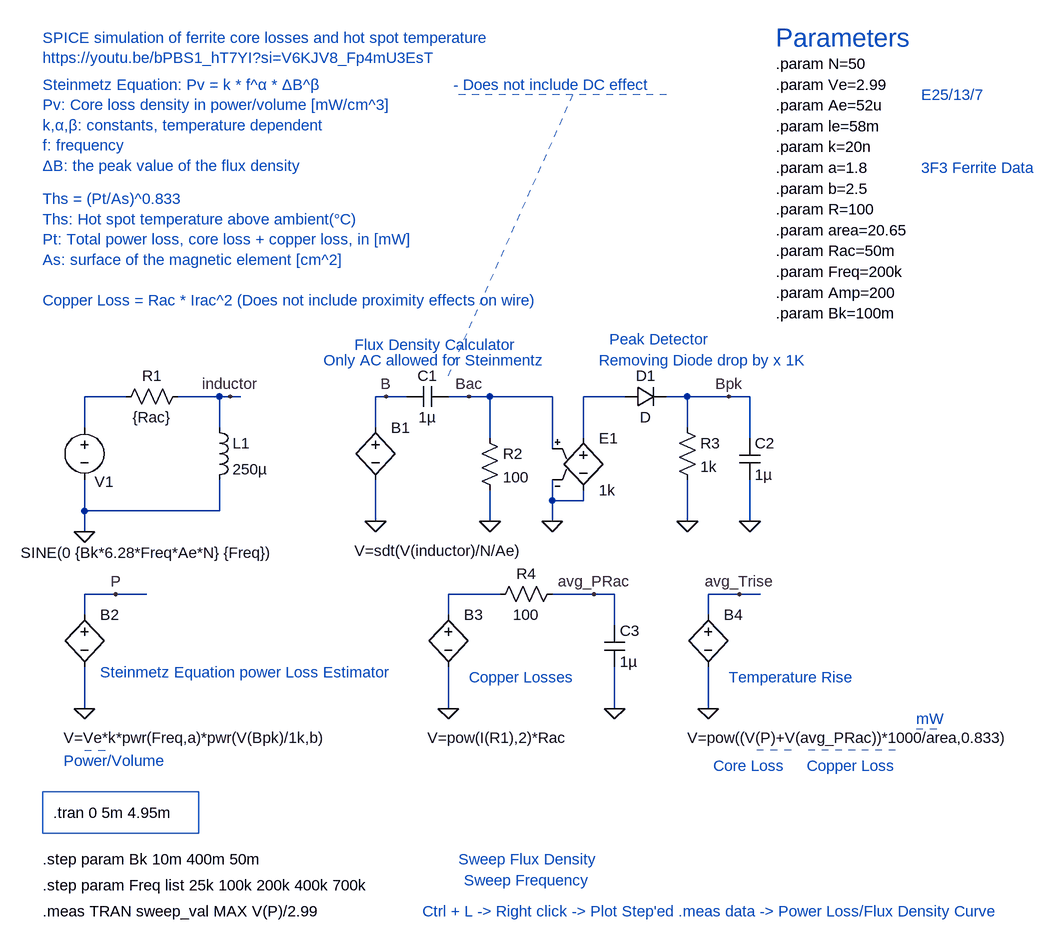
[diagram p0: schematic 05-ferrite_core_loss_max_temperature.asc]
05-ferrite_core_loss_max_temperature.asc, the LTspice schematic file:
Version 4
SHEET 1 1600 1400
WIRE -16 576 -80 576
WIRE 128 576 64 576
WIRE 144 576 128 576
WIRE 160 576 144 576
WIRE 384 576 368 576
WIRE 416 576 384 576
WIRE 512 576 480 576
WIRE 544 576 512 576
WIRE 640 576 544 576
WIRE 752 576 688 576
WIRE 848 576 816 576
WIRE 912 576 848 576
WIRE 944 576 912 576
WIRE -80 624 -80 576
WIRE 128 624 128 576
WIRE 368 624 368 576
WIRE 848 624 848 576
WIRE 544 640 544 576
WIRE 688 640 688 576
WIRE 944 640 944 576
WIRE 640 656 640 576
WIRE 640 736 640 704
WIRE 688 736 688 720
WIRE 688 736 640 736
WIRE -80 752 -80 704
WIRE 128 752 128 704
WIRE 128 752 -80 752
WIRE 368 768 368 704
WIRE 544 768 544 720
WIRE 640 768 640 736
WIRE 848 768 848 704
WIRE 944 768 944 704
WIRE -80 784 -80 752
WIRE -32 880 -80 880
WIRE 16 880 -32 880
WIRE 560 880 480 880
WIRE 704 880 640 880
WIRE 736 880 704 880
WIRE 928 880 880 880
WIRE 960 880 928 880
WIRE -80 912 -80 880
WIRE 480 912 480 880
WIRE 880 912 880 880
WIRE 736 928 736 880
WIRE -80 1056 -80 992
WIRE 480 1056 480 992
WIRE 736 1056 736 992
WIRE 880 1056 880 992
FLAG -80 784 0
FLAG 144 576 inductor
FLAG 368 768 0
FLAG 384 576 B
FLAG 544 768 0
FLAG 512 576 Bac
FLAG 640 768 0
FLAG 848 768 0
FLAG 944 768 0
FLAG 912 576 Bpk
FLAG -80 1056 0
FLAG -32 880 P
FLAG 480 1056 0
FLAG 704 880 avg_PRac
FLAG 736 1056 0
FLAG 880 1056 0
FLAG 928 880 avg_Trise
SYMBOL voltage -80 608 R0
WINDOW 0 16 99 Left 2
WINDOW 3 -98 208 Left 2
WINDOW 123 0 0 Left 0
WINDOW 39 0 0 Left 0
SYMATTR InstName V1
SYMATTR Value SINE(0 {Bk*6.28*Freq*Ae*N} {Freq})
SYMBOL res 80 560 R90
WINDOW 0 0 56 VBottom 2
WINDOW 3 32 56 VTop 2
SYMATTR InstName R1
SYMATTR Value {Rac}
SYMBOL ind 112 608 R0
SYMATTR InstName L1
SYMATTR Value 250µ
SYMBOL bv 368 608 R0
WINDOW 3 -32 205 Left 2
SYMATTR Value V=sdt(V(inductor)/N/Ae)
SYMATTR InstName B1
SYMBOL res 528 624 R0
SYMATTR InstName R2
SYMATTR Value 100
SYMBOL cap 480 560 R90
WINDOW 0 0 32 VBottom 2
WINDOW 3 32 32 VTop 2
SYMATTR InstName C1
SYMATTR Value 1µ
SYMBOL e 688 624 R0
SYMATTR InstName E1
SYMATTR Value 1k
SYMBOL diode 752 592 R270
WINDOW 0 32 32 VTop 2
WINDOW 3 0 32 VBottom 2
SYMATTR InstName D1
SYMBOL res 832 608 R0
SYMATTR InstName R3
SYMATTR Value 1k
SYMBOL cap 928 640 R0
SYMATTR InstName C2
SYMATTR Value 1µ
SYMBOL bv -80 896 R0
WINDOW 3 -32 205 Left 2
SYMATTR Value V=Ve*k*pwr(Freq,a)*pwr(V(Bpk)/1k,b)
SYMATTR InstName B2
SYMBOL bv 480 896 R0
WINDOW 3 -32 205 Left 2
SYMATTR Value V=pow(I(R1),2)*Rac
SYMATTR InstName B3
SYMBOL res 656 864 R90
WINDOW 0 0 56 VBottom 2
WINDOW 3 32 56 VTop 2
SYMATTR InstName R4
SYMATTR Value 100
SYMBOL cap 720 928 R0
SYMATTR InstName C3
SYMATTR Value 1µ
SYMBOL bv 880 896 R0
WINDOW 3 -32 205 Left 2
SYMATTR Value V=pow((V(P)+V(avg_PRac))*1000/area,0.833)
SYMATTR InstName B4
TEXT -144 24 Left 2 ;SPICE simulation of ferrite core losses and hot spot temperature\nhttps://youtu.be/bPBS1_hT7YI?si=V6KJV8_Fp4mU3EsT
TEXT -144 96 Left 2 ;Steinmetz Equation: Pv = k * f^α * ΔB^β\nPv: Core loss density in power/volume [mW/cm^3]\nk,α,β: constants, temperature dependent\nf: frequency\nΔB: the peak value of the flux density
TEXT 488 96 Left 2 ;- Does not include DC effect
TEXT -144 272 Left 2 ;Ths = (Pt/As)^0.833\nThs: Hot spot temperature above ambient(°C)\nPt: Total power loss, core loss + copper loss, in [mW]\nAs: surface of the magnetic element [cm^2]\n \nCopper Loss = Rac * Irac^2 (Does not include proximity effects on wire)
TEXT 984 64 Left 2 !.param N=50
TEXT 984 24 Left 4 ;Parameters
TEXT 984 96 Left 2 !.param Ve=2.99
TEXT 984 128 Left 2 !.param Ae=52u
TEXT 984 160 Left 2 !.param le=58m
TEXT 984 192 Left 2 !.param k=20n
TEXT 984 224 Left 2 !.param a=1.8
TEXT 984 256 Left 2 !.param b=2.5
TEXT 984 288 Left 2 !.param R=100
TEXT 984 320 Left 2 !.param area=20.65
TEXT 984 352 Left 2 !.param Rac=50m
TEXT 984 384 Left 2 !.param Freq=200k
TEXT 984 416 Left 2 !.param Amp=200
TEXT 984 448 Left 2 !.param Bk=100m
TEXT 1208 112 Left 2 ;E25/13/7
TEXT 1208 224 Left 2 ;3F3 Ferrite Data
TEXT -128 1216 Left 2 !.tran 0 5m 4.95m
TEXT -56 1000 Left 2 ;Steinmetz Equation power Loss Estimator
TEXT 336 496 Left 2 ;Flux Density Calculator
TEXT 728 488 Left 2 ;Peak Detector
TEXT 512 1008 Left 2 ;Copper Losses
TEXT 912 1008 Left 2 ;Temperature Rise
TEXT 288 520 Left 2 ;Only AC allowed for Steinmentz
TEXT 712 520 Left 2 ;Removing Diode drop by x 1K
TEXT -112 1136 Left 2 ;Power/Volume
TEXT 888 1144 Left 2 ;Core Loss
TEXT 1032 1144 Left 2 ;Copper Loss
TEXT 1200 1072 Left 2 ;mW
TEXT -144 1288 Left 2 !.step param Bk 10m 400m 50m
TEXT -144 1368 Left 2 !.meas TRAN sweep_val MAX V(P)/2.99
TEXT -144 1328 Left 2 !.step param Freq list 25k 100k 200k 400k 700k
TEXT 440 1368 Left 2 ;Ctrl + L -> Right click -> Plot Step'ed .meas data -> Power Loss/Flux Density Curve
TEXT 496 1288 Left 2 ;Sweep Flux Density
TEXT 504 1320 Left 2 ;Sweep Frequency
LINE Normal 816 112 496 112 2
LINE Normal 480 544 672 112 2
LINE Normal -80 1120 -48 1120 2
LINE Normal 1008 1120 944 1120 1
LINE Normal 1168 1120 1024 1120 1
LINE Normal 1232 1088 1200 1088 1
RECTANGLE Normal 96 1248 -144 1184

The netlist it stands for:
* 05-ferrite_core_loss_max_temperature.asc
V1 N001 0 SINE(0 {Bk*6.28*Freq*Ae*N} {Freq})
R1 inductor N001 {Rac}
L1 inductor 0 250µ
B1 B 0 V=sdt(V(inductor)/N/Ae)
R2 Bac 0 100
C1 Bac B 1µ
E1 N002 0 Bac 0 1k
D1 N002 Bpk D
R3 Bpk 0 1k
C2 Bpk 0 1µ
B2 P 0 V=Ve*k*pwr(Freq,a)*pwr(V(Bpk)/1k,b)
B3 N003 0 V=pow(I(R1),2)*Rac
R4 avg_PRac N003 100
C3 avg_PRac 0 1µ
B4 avg_Trise 0 V=pow((V(P)+V(avg_PRac))*1000/area,0.833)
.model D D
.lib standard.dio
* SPICE simulation of ferrite core losses and hot spot temperature
* https://youtu.be/bPBS1_hT7YI?si=V6KJV8_Fp4mU3EsT
* Steinmetz Equation: Pv = k * f^α * ΔB^β
* Pv: Core loss density in power/volume [mW/cm^3]
* k,α,β: constants, temperature dependent
* f: frequency
* ΔB: the peak value of the flux density
* - Does not include DC effect
* Ths = (Pt/As)^0.833
* Ths: Hot spot temperature above ambient(°C)
* Pt: Total power loss, core loss + copper loss, in [mW]
* As: surface of the magnetic element [cm^2]
* Copper Loss = Rac * Irac^2 (Does not include proximity effects on wire)
.param N=50
* Parameters
.param Ve=2.99
.param Ae=52u
.param le=58m
.param k=20n
.param a=1.8
.param b=2.5
.param R=100
.param area=20.65
.param Rac=50m
.param Freq=200k
.param Amp=200
.param Bk=100m
* E25/13/7
* 3F3 Ferrite Data
.tran 0 5m 4.95m
* Steinmetz Equation power Loss Estimator
* Flux Density Calculator
* Peak Detector
* Copper Losses
* Temperature Rise
* Only AC allowed for Steinmentz
* Removing Diode drop by x 1K
* Power/Volume
* Core Loss
* Copper Loss
* mW
.step param Bk 10m 400m 50m
.meas TRAN sweep_val MAX V(P)/2.99
.step param Freq list 25k 100k 200k 400k 700k
* Ctrl + L -> Right click -> Plot Step'ed .meas data -> Power Loss/Flux Density Curve
* Sweep Flux Density
* Sweep Frequency
.backanno
.end